# Altium schematic sheet 主板.SchDoc: 主板
size A4; Organization: Altium Limited; Address1: L3, 12a Rodborough Rd; Address2: Frenchs Forest; Address3: NSW; Address4: Australia 2086; DocumentNumber: 1; Revision: V1.0; SheetNumber: 1; SheetTotal: 6; Designer: 樊浩柏
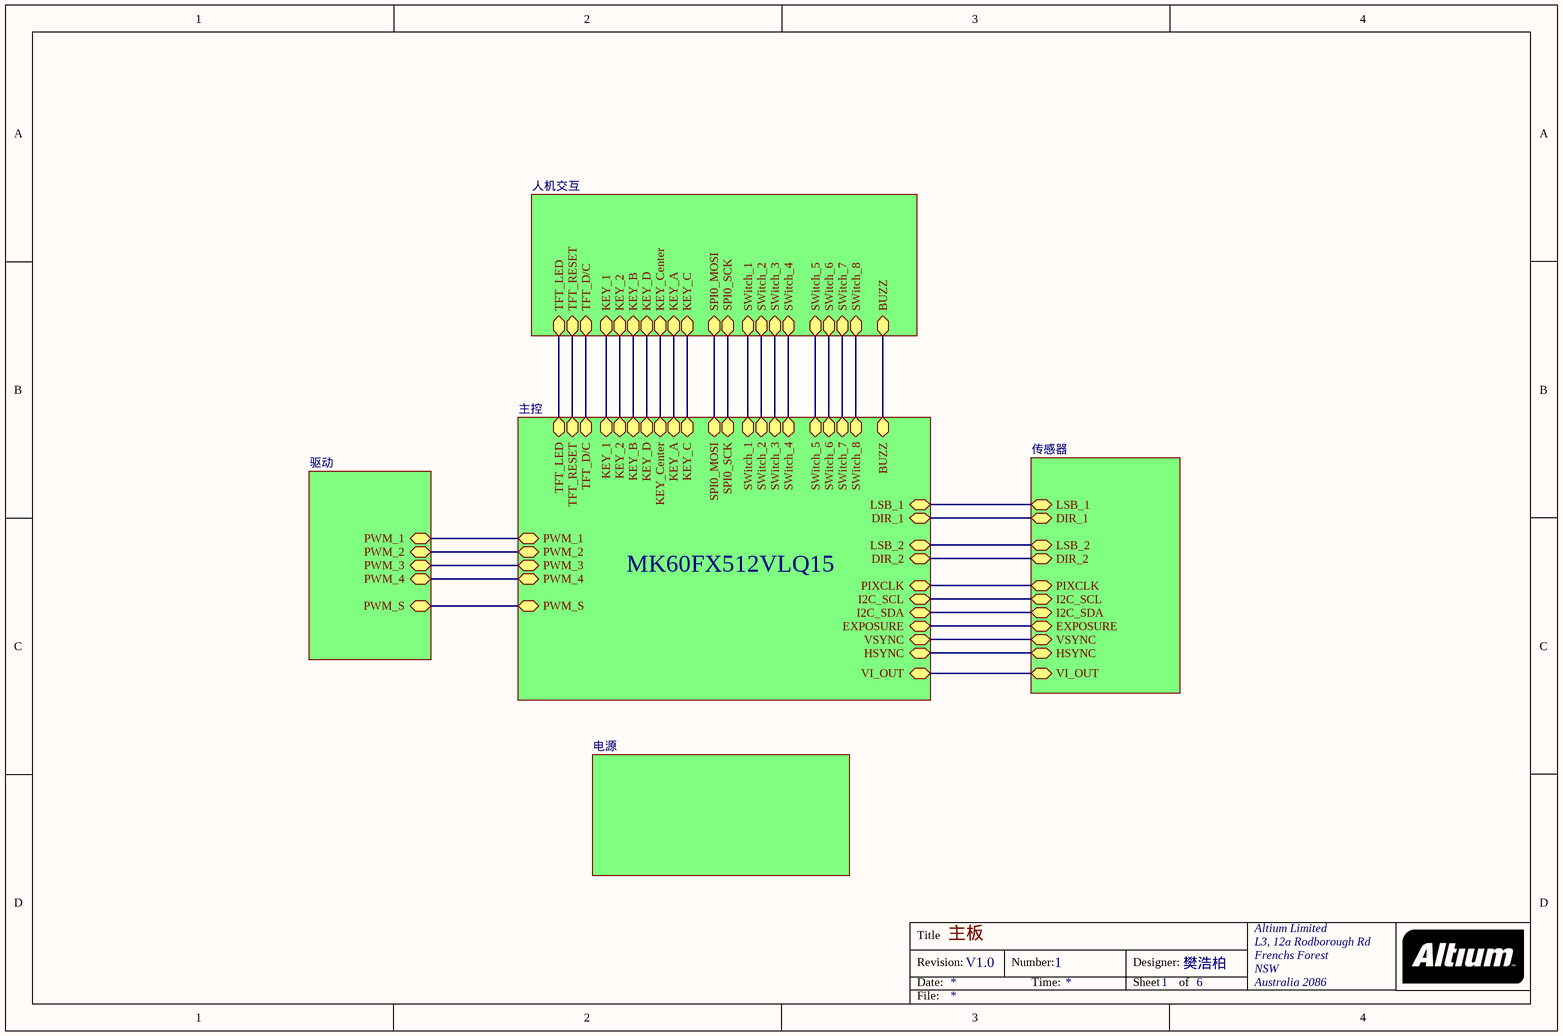
[diagram p0: 主板.SchDoc]

## Sub-sheets
主控 = 主控: PWM_1, PWM_2, PWM_3, PWM_4, PWM_S, LSB_1, DIR_1, LSB_2, DIR_2, PIXCLK, I2C_SCL, I2C_SDA, EXPOSURE, VSYNC, HSYNC, VI_OUT, TFT_LED, TFT_RESET, TFT_D/C, KEY_1, KEY_2, KEY_B, KEY_D, KEY_Center, KEY_A, KEY_C, SPI0_MOSI, SPI0_SCK, BUZZ, SWitch_1, SWitch_2, SWitch_3, SWitch_4, SWitch_5, SWitch_6, SWitch_7, SWitch_8
人机交互 = 人机交互: TFT_LED, TFT_RESET, TFT_D/C, KEY_1, KEY_2, KEY_B, KEY_D, KEY_Center, KEY_A, KEY_C, SPI0_MOSI, SPI0_SCK, BUZZ, SWitch_1, SWitch_2, SWitch_3, SWitch_4, SWitch_5, SWitch_6, SWitch_7, SWitch_8
传感器 = 传感器: LSB_1, DIR_1, LSB_2, DIR_2, PIXCLK, I2C_SCL, I2C_SDA, EXPOSURE, VSYNC, HSYNC, VI_OUT
电源 = 电源: no entries
驱动 = 驱动: PWM_1, PWM_2, PWM_3, PWM_4, PWM_S

## Nets
(unnamed): sheet 主控/PWM_1, sheet 驱动/PWM_1
(unnamed): sheet 主控/PWM_2, sheet 驱动/PWM_2
(unnamed): sheet 主控/PWM_3, sheet 驱动/PWM_3
(unnamed): sheet 主控/PWM_4, sheet 驱动/PWM_4
(unnamed): sheet 主控/PWM_S, sheet 驱动/PWM_S
(unnamed): sheet 主控/LSB_1, sheet 传感器/LSB_1
(unnamed): sheet 主控/DIR_1, sheet 传感器/DIR_1
(unnamed): sheet 主控/LSB_2, sheet 传感器/LSB_2
(unnamed): sheet 主控/DIR_2, sheet 传感器/DIR_2
(unnamed): sheet 主控/PIXCLK, sheet 传感器/PIXCLK
(unnamed): sheet 主控/I2C_SCL, sheet 传感器/I2C_SCL
(unnamed): sheet 主控/I2C_SDA, sheet 传感器/I2C_SDA
(unnamed): sheet 主控/EXPOSURE, sheet 传感器/EXPOSURE
(unnamed): sheet 主控/VSYNC, sheet 传感器/VSYNC
(unnamed): sheet 主控/HSYNC, sheet 传感器/HSYNC
(unnamed): sheet 主控/VI_OUT, sheet 传感器/VI_OUT
(unnamed): sheet 主控/TFT_LED, sheet 人机交互/TFT_LED
(unnamed): sheet 主控/TFT_RESET, sheet 人机交互/TFT_RESET
(unnamed): sheet 主控/TFT_D/C, sheet 人机交互/TFT_D/C
(unnamed): sheet 主控/KEY_1, sheet 人机交互/KEY_1
(unnamed): sheet 主控/KEY_2, sheet 人机交互/KEY_2
(unnamed): sheet 主控/KEY_B, sheet 人机交互/KEY_B
(unnamed): sheet 主控/KEY_D, sheet 人机交互/KEY_D
(unnamed): sheet 主控/KEY_Center, sheet 人机交互/KEY_Center
(unnamed): sheet 主控/KEY_A, sheet 人机交互/KEY_A
(unnamed): sheet 主控/KEY_C, sheet 人机交互/KEY_C
(unnamed): sheet 主控/SPI0_MOSI, sheet 人机交互/SPI0_MOSI
(unnamed): sheet 主控/SPI0_SCK, sheet 人机交互/SPI0_SCK
(unnamed): sheet 主控/BUZZ, sheet 人机交互/BUZZ
(unnamed): sheet 主控/SWitch_1, sheet 人机交互/SWitch_1
(unnamed): sheet 主控/SWitch_2, sheet 人机交互/SWitch_2
(unnamed): sheet 主控/SWitch_3, sheet 人机交互/SWitch_3
(unnamed): sheet 主控/SWitch_4, sheet 人机交互/SWitch_4
(unnamed): sheet 主控/SWitch_5, sheet 人机交互/SWitch_5
(unnamed): sheet 主控/SWitch_6, sheet 人机交互/SWitch_6
(unnamed): sheet 主控/SWitch_7, sheet 人机交互/SWitch_7
(unnamed): sheet 主控/SWitch_8, sheet 人机交互/SWitch_8

## Notes on the sheet
- MK60FX512VLQ15
- Title
- Revision:
- Date:
- Number:
- Time:
- Designer:
- Sheet
- of
- File: